# EAGLE schematic mbmc_connector (EAGLE 9.6.1)
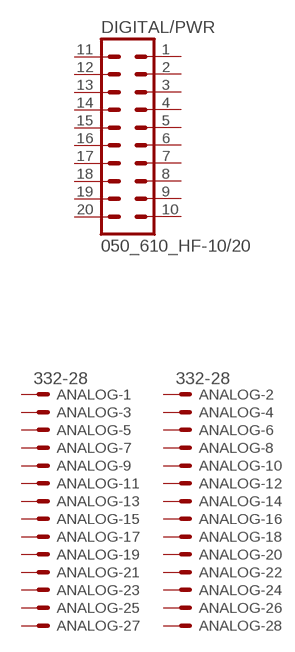
[diagram p0: schematic, sheet 1]

## Parts
ANALOG  332-28  [332-28]
DIGITAL/PWR  050_610_HF-10/20  [050_610_HF-10/20]
Unconnected: ANALOG.1 ANALOG.2 ANALOG.3 ANALOG.4 ANALOG.5 ANALOG.6 ANALOG.7 ANALOG.8 ANALOG.9 ANALOG.10 ANALOG.11 ANALOG.12 ANALOG.13 ANALOG.14 ANALOG.15 ANALOG.16 ANALOG.17 ANALOG.18 ANALOG.19 ANALOG.20 ANALOG.21 ANALOG.22 ANALOG.23 ANALOG.24 ANALOG.25 ANALOG.26 ANALOG.27 ANALOG.28 DIGITAL/PWR.1 DIGITAL/PWR.2 DIGITAL/PWR.3 DIGITAL/PWR.4 DIGITAL/PWR.5 DIGITAL/PWR.6 DIGITAL/PWR.7 DIGITAL/PWR.8 DIGITAL/PWR.9 DIGITAL/PWR.10 DIGITAL/PWR.11 DIGITAL/PWR.12 DIGITAL/PWR.13 DIGITAL/PWR.14 DIGITAL/PWR.15 DIGITAL/PWR.16 DIGITAL/PWR.17 DIGITAL/PWR.18 DIGITAL/PWR.19 DIGITAL/PWR.20

## Library data of the parts
ANALOG = con-garry:332-28: 28 Pin - 2mm Dual Row Source: www.mpe-connector.de / garry_shortform_2012.pdf
DIGITAL/PWR = con-sullinselectronics:050_610_?-10/20: .050 DIP EDGE CARD CONNECTOR .050 [1.27mm] CONTACT CENTERS .610" INSULATEOR HEIGHT Source: .050 DIP EDGE CARD.pdf; OC_FARNELL: unknown; OC_NEWARK: unknown